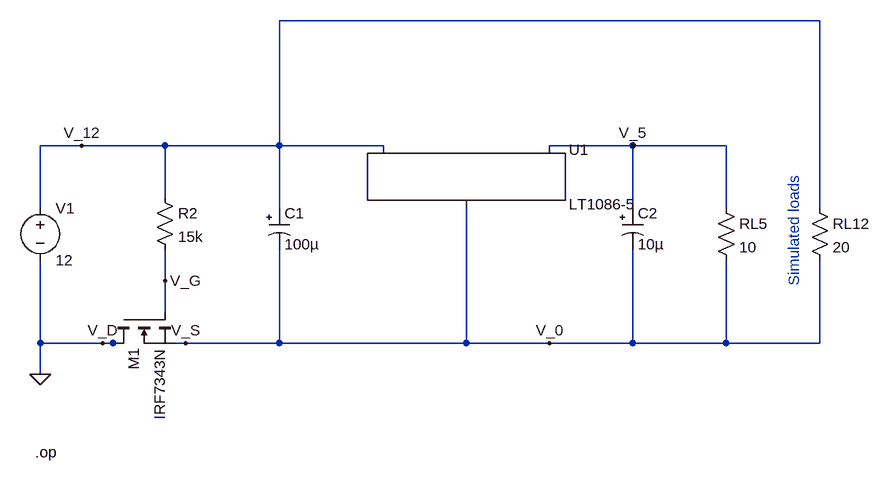
[diagram p0: schematic powersupply.asc]
powersupply.asc, the LTspice schematic file:
Version 4
SHEET 1 1152 680
WIRE 720 -80 -112 -80
WIRE -416 112 -480 112
WIRE -288 112 -416 112
WIRE -112 112 -112 -80
WIRE -112 112 -288 112
WIRE 48 112 -112 112
WIRE 432 112 304 112
WIRE 576 112 432 112
WIRE -288 192 -288 112
WIRE -480 208 -480 112
WIRE -112 208 -112 112
WIRE 432 208 432 112
WIRE 576 208 576 112
WIRE 720 208 720 -80
WIRE -288 320 -288 272
WIRE -288 368 -288 320
WIRE -480 416 -480 288
WIRE -384 416 -480 416
WIRE -368 416 -384 416
WIRE -352 416 -368 416
WIRE -256 416 -272 416
WIRE -112 416 -112 272
WIRE -112 416 -256 416
WIRE 176 416 176 208
WIRE 176 416 -112 416
WIRE 304 416 176 416
WIRE 432 416 432 272
WIRE 432 416 304 416
WIRE 576 416 576 288
WIRE 576 416 432 416
WIRE 720 416 720 288
WIRE 720 416 576 416
WIRE -480 464 -480 416
FLAG -480 464 0
FLAG -416 112 V_12
FLAG 432 112 V_5
FLAG -288 320 V_G
FLAG 304 416 V_0
FLAG -256 416 V_S
FLAG -384 416 V_D
SYMBOL PowerProducts\\LT1086-5 176 112 R0
SYMATTR InstName U1
SYMBOL nmos -368 368 M90
SYMATTR InstName M1
SYMATTR Value IRF7343N
SYMBOL res 560 192 R0
SYMATTR InstName RL5
SYMATTR Value 10
SYMATTR SpiceLine tol=5
SYMBOL voltage -480 192 R0
WINDOW 123 24 132 Left 0
WINDOW 39 0 0 Left 0
SYMATTR InstName V1
SYMATTR Value 12
SYMBOL res -304 176 R0
SYMATTR InstName R2
SYMATTR Value 15k
SYMATTR SpiceLine tol=5 pwr=.5
SYMBOL polcap -128 208 R0
SYMATTR InstName C1
SYMATTR Value 100µ
SYMATTR SpiceLine V=24
SYMBOL polcap 416 208 R0
SYMATTR InstName C2
SYMATTR Value 10µ
SYMATTR SpiceLine V=24
SYMBOL res 704 192 R0
SYMATTR InstName RL12
SYMATTR Value 20
SYMATTR SpiceLine tol=5
TEXT 680 328 VLeft 0 ;Simulated loads
TEXT -488 584 Left 0 !.op

The netlist it stands for:
* powersupply.asc
XU1 V_S V_5 V_12 LT1086-5
M1 0 V_G V_S V_S IRF7343N
RL5 V_5 V_S 10 tol=5
V1 V_12 0 12
R2 V_12 V_G 15k tol=5 pwr=.5
C1 V_12 V_S 100µ V=24
C2 V_5 V_S 10µ V=24
RL12 V_12 V_S 20 tol=5
.model NMOS NMOS
.model PMOS PMOS
.lib standard.mos
* Simulated loads
.op
.backanno
.end